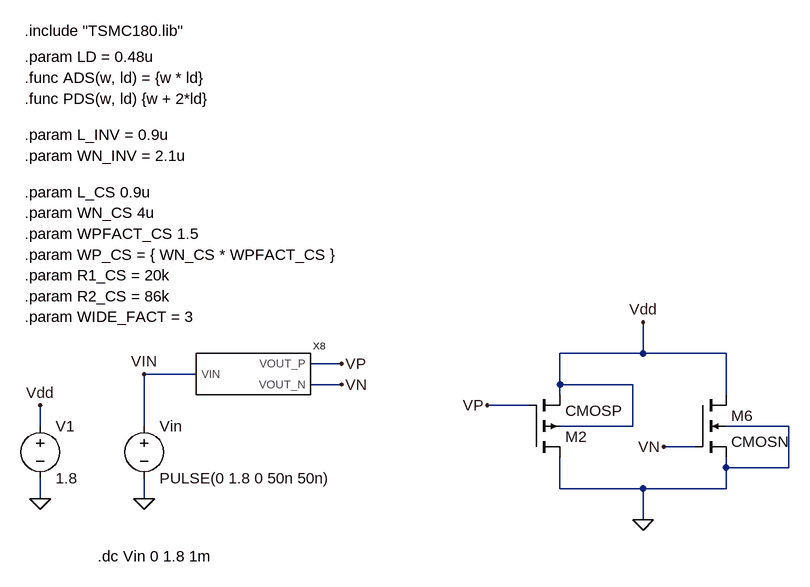
[diagram p0: schematic vco_current_souurce_test2.asc]
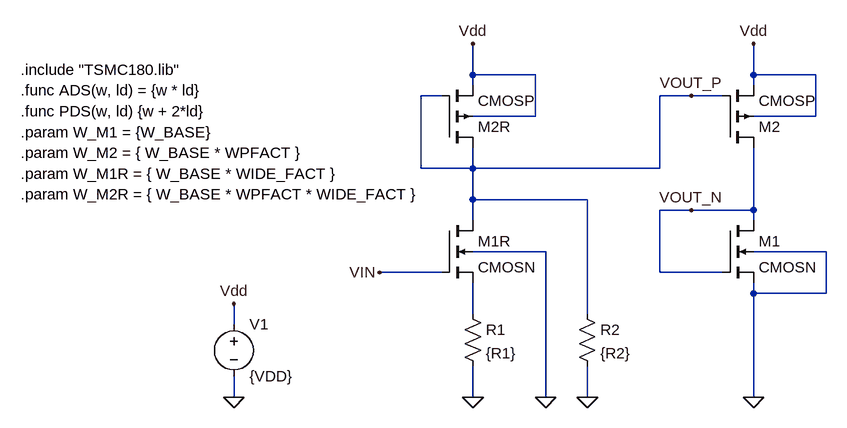
[diagram p1: sub-circuit vco_current_source.asc]
vco_current_souurce_test2.asc, the LTspice schematic file:
Version 4
SHEET 1 3496 1412
WIRE 736 384 736 336
WIRE 736 384 608 384
WIRE 864 384 736 384
WIRE 272 400 224 400
WIRE 48 416 -32 416
WIRE 272 432 224 432
WIRE 608 432 608 384
WIRE 720 432 608 432
WIRE 608 448 608 432
WIRE 864 448 864 384
WIRE 560 464 496 464
WIRE -192 496 -192 464
WIRE -32 496 -32 416
WIRE 720 496 720 432
WIRE 720 496 608 496
WIRE 960 496 864 496
WIRE 816 528 768 528
WIRE 864 560 864 544
WIRE 960 560 960 496
WIRE 960 560 864 560
WIRE 608 592 608 544
WIRE 736 592 608 592
WIRE 864 592 864 560
WIRE 864 592 736 592
WIRE -192 608 -192 576
WIRE -32 608 -32 576
WIRE 736 640 736 592
FLAG -192 608 0
FLAG -192 464 Vdd
FLAG -32 608 0
FLAG -32 416 VIN
FLAG 272 400 VP
FLAG 272 432 VN
FLAG 496 464 VP
FLAG 768 528 VN
FLAG 736 640 0
FLAG 736 336 Vdd
SYMBOL voltage -192 480 R0
WINDOW 123 0 0 Left 0
WINDOW 39 0 0 Left 0
SYMATTR InstName V1
SYMATTR Value 1.8
SYMBOL voltage -32 480 R0
WINDOW 123 0 0 Left 0
WINDOW 39 0 0 Left 0
SYMATTR InstName Vin
SYMATTR Value PULSE(0 1.8 0 50n 50n)
SYMBOL vco_current_source 96 416 R0
SYMATTR SpiceLine VDD=1.8 L={L_CS} W_BASE={WN_CS} WPFACT={WPFACT_CS} WIDE_FACT={WIDE_FACT} LD=0.48u R1={R1_CS} R2={R2_CS}
SYMATTR InstName X8
SYMBOL pmos4 560 544 M180
SYMATTR InstName M2
SYMATTR Value CMOSP
SYMATTR Value2 l={L_CS} w={WP_CS} ad={ADS(WP_CS, LD)} as={ADS(WP_CS, LD)} pd={PDS(WP_CS, LD)} ps={PDS(WP_CS, LD)}
SYMBOL nmos4 816 448 R0
SYMATTR InstName M6
SYMATTR Value CMOSN
SYMATTR Value2 l={L_CS} w={WN_CS} ad={ADS(WN_CS, LD)} as={ADS(WN_CS, LD)} pd={PDS(WN_CS, LD)} ps={PDS(WN_CS, LD)}
TEXT -216 -112 Left 2 !.include "TSMC180.lib"
TEXT -216 -40 Left 2 !.func ADS(w, ld) = {w * ld}
TEXT -216 -8 Left 2 !.func PDS(w, ld) {w + 2*ld}
TEXT -216 -72 Left 2 !.param LD = 0.48u
TEXT -104 696 Left 2 !.dc Vin 0 1.8 1m
TEXT -216 136 Left 2 !.param L_CS 0.9u
TEXT -216 168 Left 2 !.param WN_CS 4u
TEXT -216 200 Left 2 !.param WPFACT_CS 1.5
TEXT -216 232 Left 2 !.param WP_CS = { WN_CS * WPFACT_CS }
TEXT -216 48 Left 2 !.param L_INV = 0.9u
TEXT -216 80 Left 2 !.param WN_INV = 2.1u
TEXT -216 264 Left 2 !.param R1_CS = 20k
TEXT -216 328 Left 2 !.param WIDE_FACT = 3
TEXT -216 296 Left 2 !.param R2_CS = 86k

vco_current_source.asc, the sub-circuit schematic file:
Version 4
SHEET 1 2388 904
WIRE 512 -96 512 -144
WIRE 608 -96 512 -96
WIRE 944 -96 944 -144
WIRE 1040 -96 944 -96
WIRE 512 -80 512 -96
WIRE 944 -80 944 -96
WIRE 464 -64 432 -64
WIRE 848 -64 800 -64
WIRE 896 -64 848 -64
WIRE 608 -32 608 -96
WIRE 608 -32 512 -32
WIRE 1040 -32 1040 -96
WIRE 1040 -32 944 -32
WIRE 432 48 432 -64
WIRE 512 48 512 16
WIRE 512 48 432 48
WIRE 800 48 800 -64
WIRE 800 48 512 48
WIRE 512 96 512 48
WIRE 688 96 512 96
WIRE 848 112 800 112
WIRE 944 112 944 16
WIRE 944 112 848 112
WIRE 512 128 512 96
WIRE 944 128 944 112
WIRE 624 176 512 176
WIRE 1056 176 944 176
WIRE 464 208 368 208
WIRE 800 208 800 112
WIRE 896 208 800 208
WIRE 944 240 944 224
WIRE 1056 240 1056 176
WIRE 1056 240 944 240
WIRE 512 272 512 224
WIRE 688 272 688 96
WIRE 144 288 144 256
WIRE 144 400 144 368
WIRE 512 400 512 352
WIRE 624 400 624 176
WIRE 688 400 688 352
WIRE 944 400 944 240
FLAG 144 400 0
FLAG 144 256 Vdd
FLAG 368 208 VIN
FLAG 512 -144 Vdd
FLAG 512 400 0
FLAG 944 -144 Vdd
FLAG 624 400 0
FLAG 944 400 0
FLAG 848 -64 VOUT_P
FLAG 848 112 VOUT_N
FLAG 688 400 0
SYMBOL voltage 144 272 R0
WINDOW 123 0 0 Left 0
WINDOW 39 0 0 Left 0
SYMATTR InstName V1
SYMATTR Value {VDD}
SYMBOL pmos4 464 16 M180
SYMATTR InstName M2R
SYMATTR Value CMOSP
SYMATTR Value2 l={L} w={W_M2R} ad={ADS(W_M2R, LD)} as={ADS(W_M2R, LD)} pd={PDS(W_M2R, LD)} ps={PDS(W_M2R, LD)}
SYMBOL nmos4 464 128 R0
SYMATTR InstName M1R
SYMATTR Value CMOSN
SYMATTR Value2 l={L} w={W_M1R} ad={ADS(W_M1R, LD)} as={ADS(W_M1R, LD)} pd={PDS(W_M1R, LD)} ps={PDS(W_M1R, LD)}
SYMBOL res 496 256 R0
SYMATTR InstName R1
SYMATTR Value {R1}
SYMBOL pmos4 896 16 M180
SYMATTR InstName M2
SYMATTR Value CMOSP
SYMATTR Value2 l={L} w={W_M2} ad={ADS(W_M2, LD)} as={ADS(W_M2, LD)} pd={PDS(W_M2, LD)} ps={PDS(W_M2, LD)}
SYMBOL nmos4 896 128 R0
SYMATTR InstName M1
SYMATTR Value CMOSN
SYMATTR Value2 l={L} w={W_M1} ad={ADS(W_M1, LD)} as={ADS(W_M1, LD)} pd={PDS(W_M1, LD)} ps={PDS(W_M1, LD)}
SYMBOL res 672 256 R0
SYMATTR InstName R2
SYMATTR Value {R2}
TEXT -184 -104 Left 2 !.include "TSMC180.lib"
TEXT -184 -72 Left 2 !.func ADS(w, ld) = {w * ld}
TEXT -184 -40 Left 2 !.func PDS(w, ld) {w + 2*ld}
TEXT -184 56 Left 2 !.param W_M1R = { W_BASE * WIDE_FACT }
TEXT -184 88 Left 2 !.param W_M2R = { W_BASE * WPFACT * WIDE_FACT }
TEXT -184 -8 Left 2 !.param W_M1 = {W_BASE}
TEXT -184 24 Left 2 !.param W_M2 = { W_BASE * WPFACT }

The netlist it stands for:
* vco_current_souurce_test2.asc
V1 Vdd 0 1.8
Vin VIN 0 PULSE(0 1.8 0 50n 50n)
XX8 VIN VP VN vco_current_source params: VDD=1.8 L={L_CS} W_BASE={WN_CS} WPFACT={WPFACT_CS} WIDE_FACT={WIDE_FACT} LD=0.48u R1={R1_CS} R2={R2_CS}
M2 0 VP Vdd Vdd CMOSP l={L_CS} w={WP_CS} ad={ADS(WP_CS, LD)} as={ADS(WP_CS, LD)} pd={PDS(WP_CS, LD)} ps={PDS(WP_CS, LD)}
M6 Vdd VN 0 0 CMOSN l={L_CS} w={WN_CS} ad={ADS(WN_CS, LD)} as={ADS(WN_CS, LD)} pd={PDS(WN_CS, LD)} ps={PDS(WN_CS, LD)}

* block symbol definitions
.subckt vco_current_source VIN VOUT_P VOUT_N
V1 Vdd 0 {VDD}
M2R VOUT_P VOUT_P Vdd Vdd CMOSP l={L} w={W_M2R} ad={ADS(W_M2R, LD)} as={ADS(W_M2R, LD)} pd={PDS(W_M2R, LD)} ps={PDS(W_M2R, LD)}
M1R VOUT_P VIN N001 0 CMOSN l={L} w={W_M1R} ad={ADS(W_M1R, LD)} as={ADS(W_M1R, LD)} pd={PDS(W_M1R, LD)} ps={PDS(W_M1R, LD)}
R1 N001 0 {R1}
M2 VOUT_N VOUT_P Vdd Vdd CMOSP l={L} w={W_M2} ad={ADS(W_M2, LD)} as={ADS(W_M2, LD)} pd={PDS(W_M2, LD)} ps={PDS(W_M2, LD)}
M1 VOUT_N VOUT_N 0 0 CMOSN l={L} w={W_M1} ad={ADS(W_M1, LD)} as={ADS(W_M1, LD)} pd={PDS(W_M1, LD)} ps={PDS(W_M1, LD)}
R2 VOUT_P 0 {R2}
.include "TSMC180.lib"
.func ADS(w, ld) = {w * ld}
.func PDS(w, ld) {w + 2*ld}
.param W_M1R = { W_BASE * WIDE_FACT }
.param W_M2R = { W_BASE * WPFACT * WIDE_FACT }
.param W_M1 = {W_BASE}
.param W_M2 = { W_BASE * WPFACT }
.ends vco_current_source

.model NMOS NMOS
.model PMOS PMOS
.lib standard.mos
.include "TSMC180.lib"
.func ADS(w, ld) = {w * ld}
.func PDS(w, ld) {w + 2*ld}
.param LD = 0.48u
.dc Vin 0 1.8 1m
.param L_CS 0.9u
.param WN_CS 4u
.param WPFACT_CS 1.5
.param WP_CS = { WN_CS * WPFACT_CS }
.param L_INV = 0.9u
.param WN_INV = 2.1u
.param R1_CS = 20k
.param WIDE_FACT = 3
.param R2_CS = 86k
.backanno
.end